# Altium schematic sheet leds.SchDoc
size A3 portrait; SheetNumber: 3; SheetTotal: 7
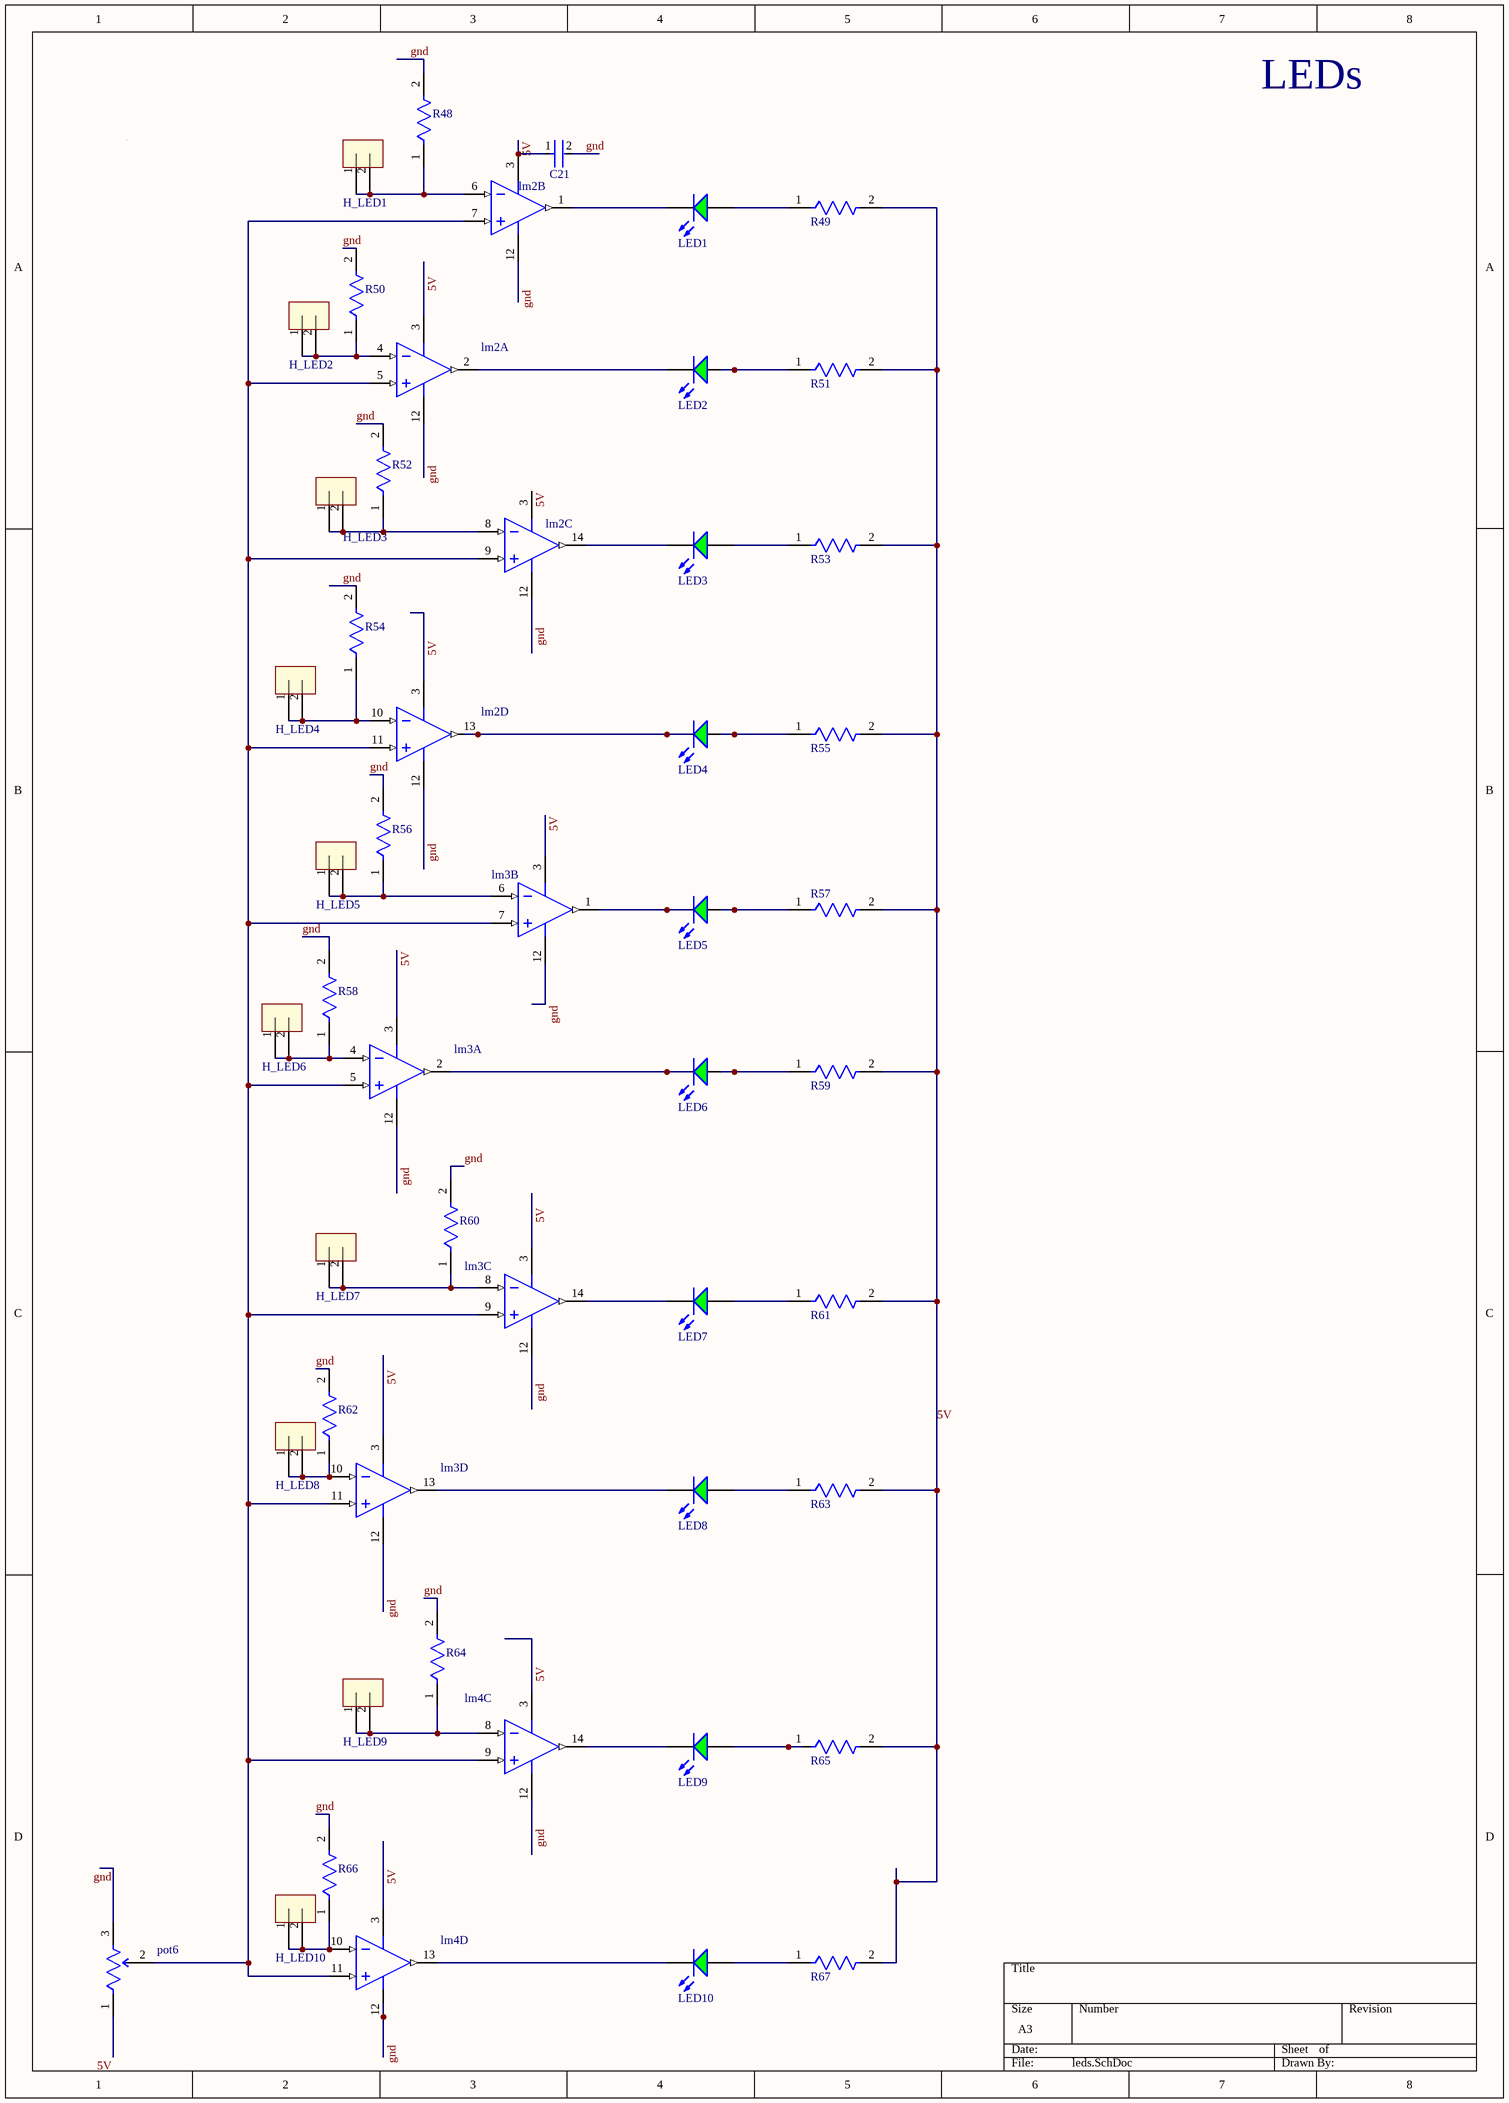
[diagram p0: leds.SchDoc]

## Parts
C21  RCER71H335K3K1H03B  [FP-RCE3M1-MFG]  (value not drawn)
H_LED1  header 2x1  [header 2x1]  (value not drawn)
H_LED2  header 2x1  [header 2x1]  (value not drawn)
H_LED3  header 2x1  [header 2x1]  (value not drawn)
H_LED4  header 2x1  [header 2x1]  (value not drawn)
H_LED5  header 2x1  [header 2x1]  (value not drawn)
H_LED6  header 2x1  [header 2x1]  (value not drawn)
H_LED7  header 2x1  [header 2x1]  (value not drawn)
H_LED8  header 2x1  [header 2x1]  (value not drawn)
H_LED9  header 2x1  [header 2x1]  (value not drawn)
H_LED10  header 2x1  [header 2x1]  (value not drawn)
LED1  WP7113SGD  [KING-WP7113SGD_V]  (value not drawn)
LED2  WP7113SGD  [KING-WP7113SGD_V]  (value not drawn)
LED3  WP7113SGD  [KING-WP7113SGD_V]  (value not drawn)
LED4  WP7113SGD  [KING-WP7113SGD_V]  (value not drawn)
LED5  WP7113SGD  [KING-WP7113SGD_V]  (value not drawn)
LED6  WP7113SGD  [KING-WP7113SGD_V]  (value not drawn)
LED7  WP7113SGD  [KING-WP7113SGD_V]  (value not drawn)
LED8  WP7113SGD  [KING-WP7113SGD_V]  (value not drawn)
LED9  WP7113SGD  [KING-WP7113SGD_V]  (value not drawn)
LED10  WP7113SGD  [KING-WP7113SGD_V]  (value not drawn)
lm2  LM339J  [J0014A]  (value not drawn)  (parts A,B,C,D of 4)
lm3  LM339J  [J0014A]  (value not drawn)  (parts A,B,C,D of 4)
lm4  LM339J  [J0014A]  (value not drawn)  (parts C,D of 4)
pot6  3296W-1-501LF  [FP-3296W-MFG]  (value not drawn)
R48  MRS16000C2002FCT00  [FP-MRS1600-MFG]  (value not drawn)
R49  MRS16000C2002FCT00  [FP-MRS1600-MFG]  (value not drawn)
R50  MRS16000C2002FCT00  [FP-MRS1600-MFG]  (value not drawn)
R51  MRS16000C2002FCT00  [FP-MRS1600-MFG]  (value not drawn)
R52  MRS16000C2002FCT00  [FP-MRS1600-MFG]  (value not drawn)
R53  MRS16000C2002FCT00  [FP-MRS1600-MFG]  (value not drawn)
R54  MRS16000C2002FCT00  [FP-MRS1600-MFG]  (value not drawn)
R55  MRS16000C2002FCT00  [FP-MRS1600-MFG]  (value not drawn)
R56  MRS16000C2002FCT00  [FP-MRS1600-MFG]  (value not drawn)
R57  MRS16000C2002FCT00  [FP-MRS1600-MFG]  (value not drawn)
R58  MRS16000C2002FCT00  [FP-MRS1600-MFG]  (value not drawn)
R59  MRS16000C2002FCT00  [FP-MRS1600-MFG]  (value not drawn)
R60  MRS16000C2002FCT00  [FP-MRS1600-MFG]  (value not drawn)
R61  MRS16000C2002FCT00  [FP-MRS1600-MFG]  (value not drawn)
R62  MRS16000C2002FCT00  [FP-MRS1600-MFG]  (value not drawn)
R63  MRS16000C2002FCT00  [FP-MRS1600-MFG]  (value not drawn)
R64  MRS16000C2002FCT00  [FP-MRS1600-MFG]  (value not drawn)
R65  MRS16000C2002FCT00  [FP-MRS1600-MFG]  (value not drawn)
R66  MRS16000C2002FCT00  [FP-MRS1600-MFG]  (value not drawn)
R67  MRS16000C2002FCT00  [FP-MRS1600-MFG]  (value not drawn)

## Nets
5V: C21.1 lm2.3(V+) lm3.3(V+) lm4.3(V+) pot6.1(CCW) R49.2 R51.2 R53.2 R55.2 R57.2 R59.2 R61.2 R63.2 R65.2 R67.2
gnd: C21.2 lm2.12(GND) lm3.12(GND) lm4.12(GND) pot6.3(CW) R48.2 R50.2 R52.2 R54.2 R56.2 R58.2 R60.2 R62.2 R64.2 R66.2
NetH_LED1_1: H_LED1.1 H_LED1.2 lm2.6(IN2-) R48.1
NetH_LED2_1: H_LED2.1 H_LED2.2 lm2.4(IN1-) R50.1
NetH_LED3_1: H_LED3.1 H_LED3.2 lm2.8(IN3-) R52.1
NetH_LED4_1: H_LED4.1 H_LED4.2 lm2.10(IN4-) R54.1
NetH_LED5_1: H_LED5.1 H_LED5.2 lm3.6(IN2-) R56.1
NetH_LED6_1: H_LED6.1 H_LED6.2 lm3.4(IN1-) R58.1
NetH_LED7_1: H_LED7.1 H_LED7.2 lm3.8(IN3-) R60.1
NetH_LED8_1: H_LED8.1 H_LED8.2 lm3.10(IN4-) R62.1
NetH_LED9_1: H_LED9.1 H_LED9.2 lm4.8(IN3-) R64.1
NetH_LED10_1: H_LED10.1 H_LED10.2 lm4.10(IN4-) R66.1
NetLED1_1: LED1.1(A) R49.1
NetLED1_2: LED1.2(K) lm2.1(OUT2)
NetLED2_1: LED2.1(A) R51.1
NetLED2_2: LED2.2(K) lm2.2(OUT1)
NetLED3_1: LED3.1(A) R53.1
NetLED3_2: LED3.2(K) lm2.14(OUT3)
NetLED4_1: LED4.1(A) R55.1
NetLED4_2: LED4.2(K) lm2.13(OUT4)
NetLED5_1: LED5.1(A) R57.1
NetLED5_2: LED5.2(K) lm3.1(OUT2)
NetLED6_1: LED6.1(A) R59.1
NetLED6_2: LED6.2(K) lm3.2(OUT1)
NetLED7_1: LED7.1(A) R61.1
NetLED7_2: LED7.2(K) lm3.14(OUT3)
NetLED8_1: LED8.1(A) R63.1
NetLED8_2: LED8.2(K) lm3.13(OUT4)
NetLED9_1: LED9.1(A) R65.1
NetLED9_2: LED9.2(K) lm4.14(OUT3)
NetLED10_1: LED10.1(A) R67.1
NetLED10_2: LED10.2(K) lm4.13(OUT4)
Netlm2_5: lm2.5(IN1+) lm2.7(IN2+) lm2.9(IN3+) lm2.11(IN4+) lm3.5(IN1+) lm3.7(IN2+) lm3.9(IN3+) lm3.11(IN4+) lm4.9(IN3+) lm4.11(IN4+) pot6.2(WIPER)

## Notes on the sheet
- LEDs

## Library data of the parts
C21 = CMP-06035-028451-1: Cap Ceramic 3.3uF 50V X7R ±10% Radial 5mm +125°C Automotive Ammo Pack; Lead Diameter: 0.5mm; Lead/Base Style: Formed Leads; Height: 5mm; Ratings: AEC-Q200; Capacitance: 3.3uF; Package Quantity: 500; Length: 0.217inch; Min Operating Temperature: -55°C; Voltage Rating (DC): 50V; Dielectric: X7R; Case/Package: Radial; Height - Seated (Max): 0.197inch; Termination: Radial; Mount: Through Hole; Max Operating Temperature: 125°C; Width: 0.157inch; Voltage Rating: 50V; Packaging: Bulk; Resistor Type: Ceramic; Tolerance: 10%; Lead Pitch: 0.197inch
H_LED1-H_LED10 = Heade 1x2: header male 2 pin; pin to pad: 1>C1 2>C2; Parameter 1: H2x1; Parameter 2: *
LED1-LED10 = CMP-2100-03698-1: LED Green, 62.5 mW, 25 mA, -40 to 85 degC, 2-Pin THD, RoHS, Bulk; Manufacturer: Kingbright; Viewing Angle: 30degrees; Lens Style: Tinted; Test Current: 20mA; Forward Voltage: 2.2V; Wavelength: 568nm; Luminous Intensity: 40mcd; Package Reference: WP7113SGD; Colour: Green; Lead Free: LeadFree; Packaging: Bulk; RoHSCompliant: true; Package Quantity: 1000; Illumination Colour: Green; Case/Package: Radial; Datasheet URL: http://www.kingbrightusa.com/images/catalog/SPEC/WP7113SGD.pdf; Dominant Wavelength: 568nm; Datasheet Version: Rev. 6B, 01/2015; Package Description: 2-Pin Through Hole Device, Dia 5.9 mm, Body Length 8.6 mm; Height: 8.6mm
lm2-lm4 = CMP-0060-00012-3: Low Power Low Offset Voltage Quad Comparator, 14-pin CerDIP; Manufacturer: Texas Instruments; PowerWise: N; PackageTopMarking: NSUZXYYTT*LM339J; PackageDescription: Cerdip, .400 x .310in Body, 14 Lead, .300in Centers, .100in Pitch; ComponentLink1Description: Datasheet URL; PinCount: 14; PackageReference: J0014A; ComponentLink1URL: http://www.ti.com/general/docs/lit/getliterature.tsp?genericPartNumber=LM339-N&fileType=pdf; CompType: Comparator; RoHS: N
pot6 = CMP-07234-000046-1: TRIMMER 500 OHM 0.5W PC PIN TOP; Resistance: 500R; Temperature Coefficient: 100ppm/°C; Resistance Tolerance: 10%; Number of Turns: 25; Max Power Dissipation: 500mW; Packaging: Rail/Tube; Color: Blue; Technology: CERMET; Max Operating Temperature: 125°C; RoHS Compliant: Yes; Radiation Hardening: No; Series: 3296; Military Standard: Not; Width: 9.53mm; Weight: 0.03oz; Length: 9.53mm; Package Quantity: 50; Height: 0.395inch; Min Operating Temperature: -55°C; Lead Free: Lead Free; Mount: Through Hole; Depth: 4.83mm; Termination: Pin; Taper: Linear; Contact Plating: Tin; Resistor Type: Cermet; Tolerance: 10%; REACH SVHC: No SVHC; Power Rating: 500mW
R48-R67 = CMP-02408-000019-1: RES 20K OHM 0.4W 1% AXIAL; Max Power Dissipation: 400mW; Temperature Coefficient: 50ppm/°C; Resistance: 20kR; Technology: THIN FILM; Max Operating Temperature: 155°C; Number of Terminations: 2; RoHS Compliant: Yes; Packaging: Tape and Reel; Radiation Hardening: No; Contact Plating: Tin; Military Standard: Not; Construction: Cylindrical; Diameter: 1.6mm; Tolerance: 1%; Mount: Through Hole; Power Rating: 400mW; Case/Package: Conformal; Termination: Axial; Length: 3.6mm; Min Operating Temperature: -55°C; Resistor Type: Metal Film; Series: MRS16